# Altium schematic sheet 野火_EBF6ULL F1 核心板_原理图封装参考设计_AD格式.SchDoc
size 431 x 279 mm
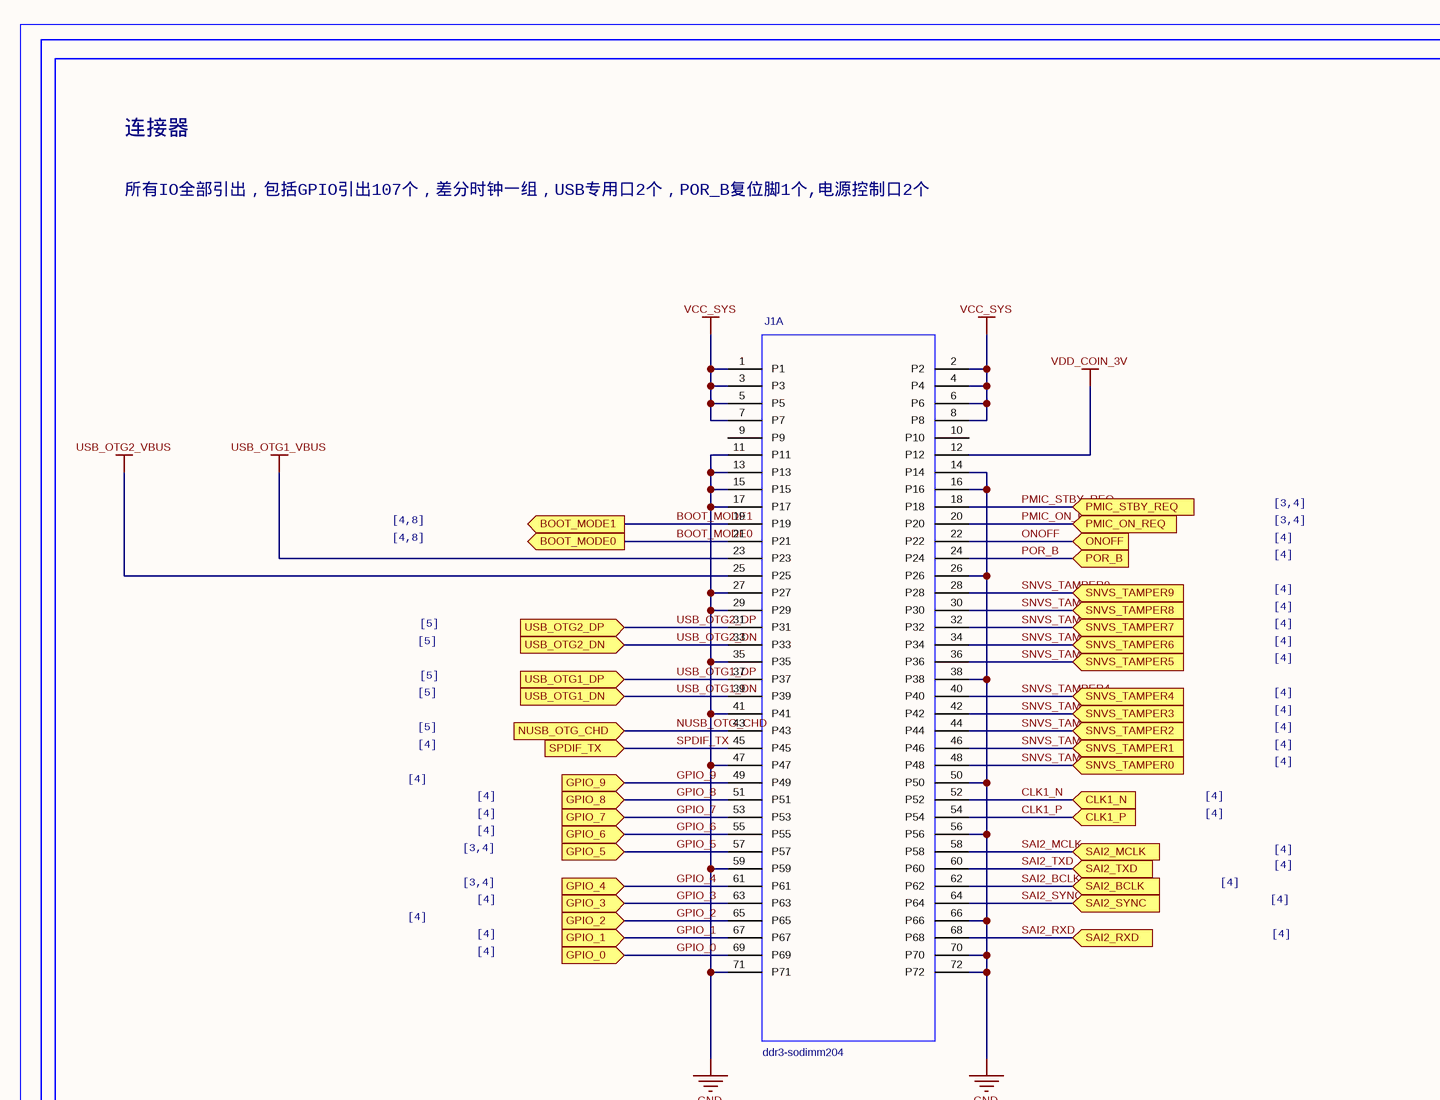
[diagram p0: 野火_EBF6ULL F1 核心板_原理图封装参考设计_AD格式.SchDoc, top left]
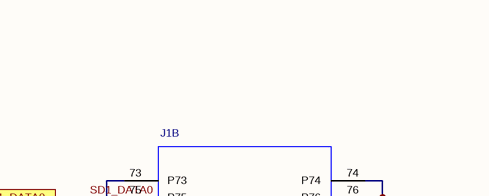
[diagram p1: 野火_EBF6ULL F1 核心板_原理图封装参考设计_AD格式.SchDoc, top right]
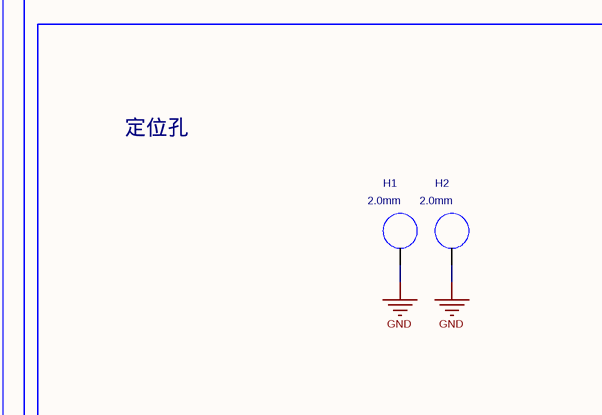
[diagram p2: 野火_EBF6ULL F1 核心板_原理图封装参考设计_AD格式.SchDoc, bottom left]
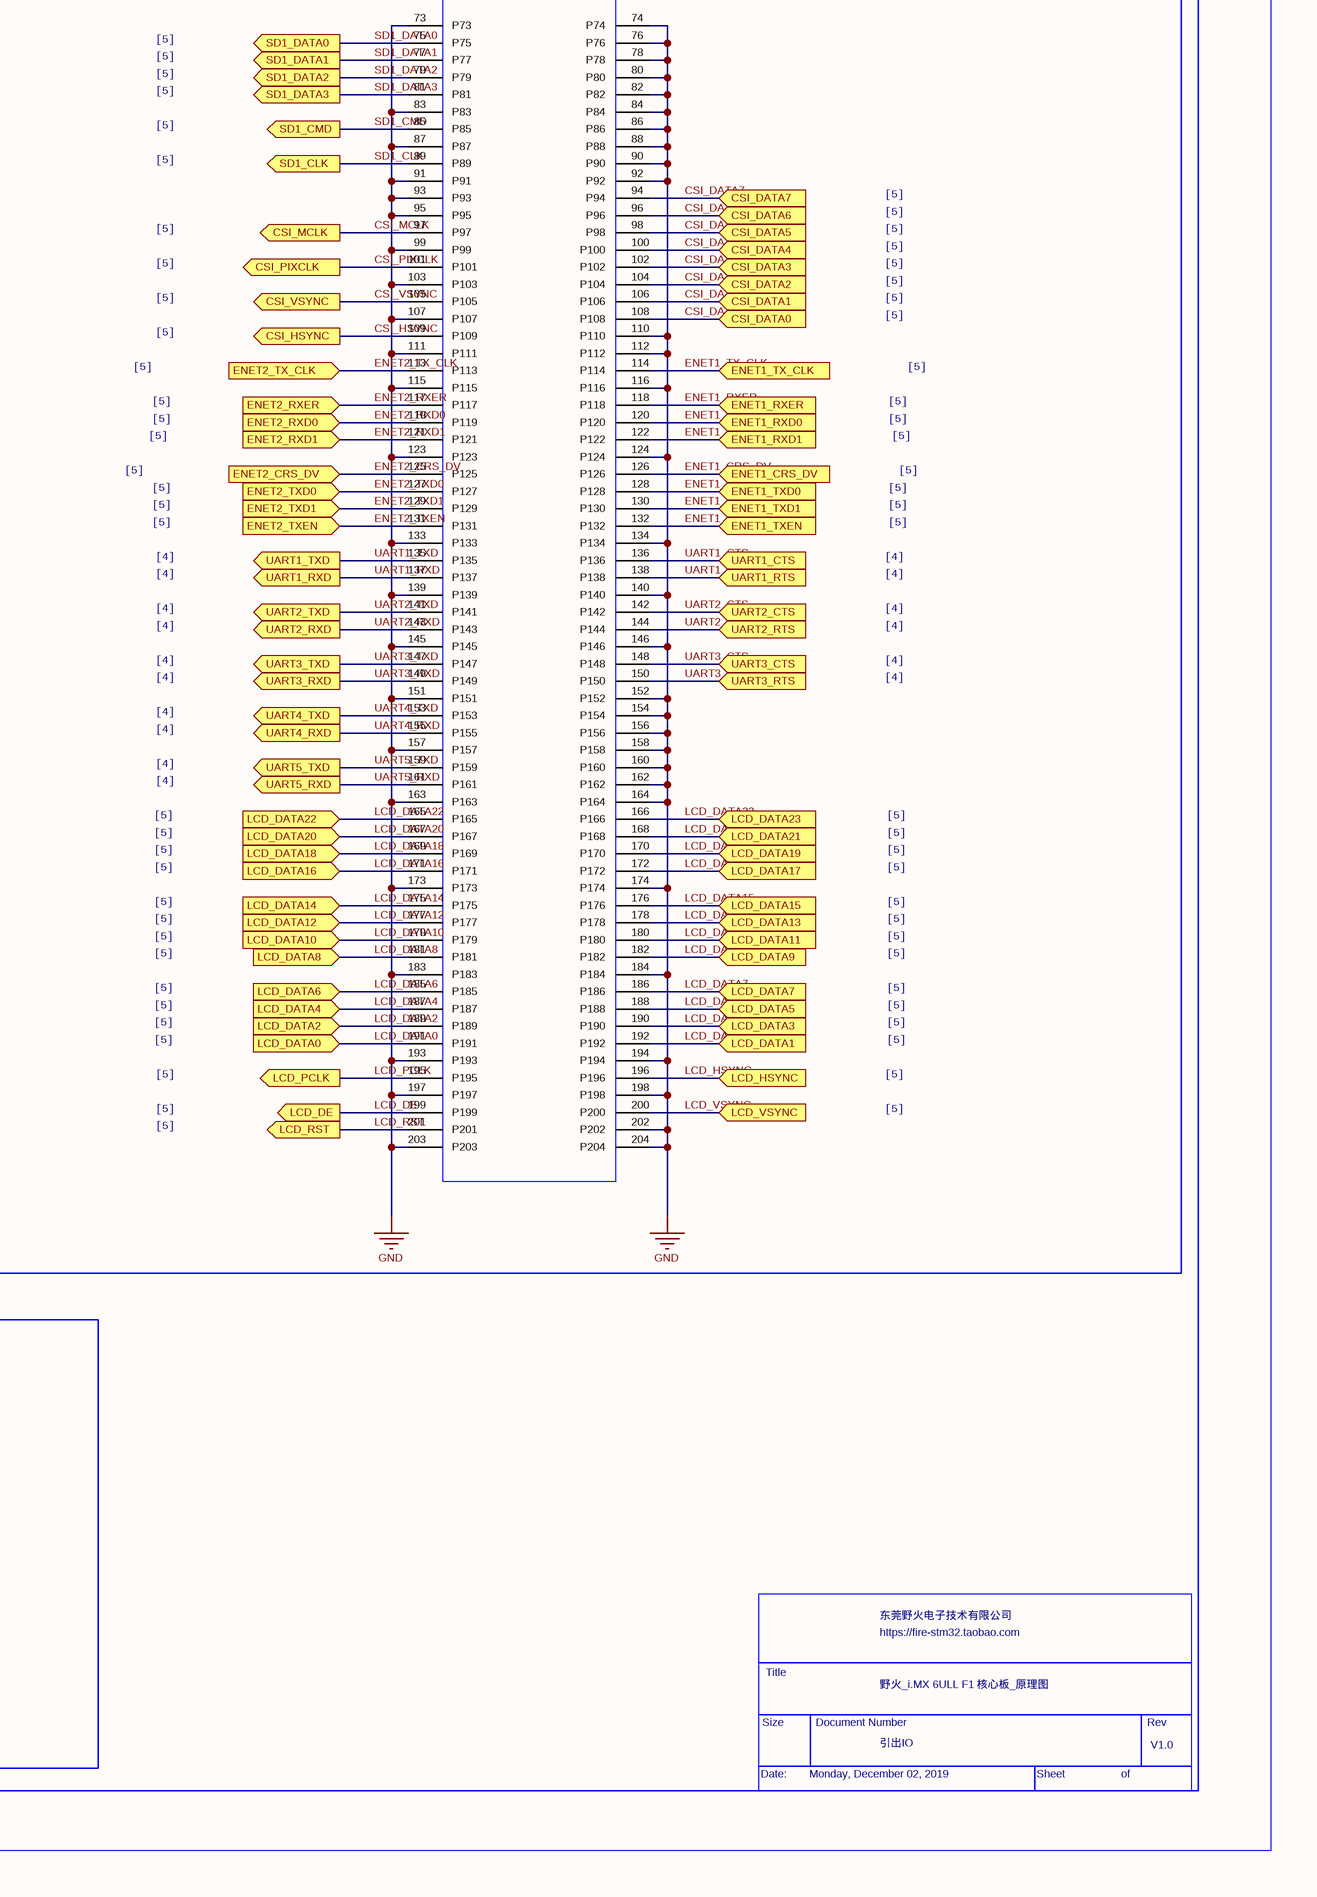
[diagram p3: 野火_EBF6ULL F1 核心板_原理图封装参考设计_AD格式.SchDoc, bottom right]

## Parts
H1  value 2.0mm  [T2_5-4]  (hidden comment: SPACER_0)
H2  value 2.0mm  [T2_5-4]  (hidden comment: SPACER_0)
J1  DDR3-SODIMM204  [DDR3-SODIMM204-GOLD_FINGER]  (parts A,B of 2)

## Blocks framed on the sheet
连接器: J1
定位孔: H1 H2

## Ports
BOOT_MODE0 (out), BOOT_MODE1 (out), CLK1_N, CLK1_P, CSI_DATA0 (in), CSI_DATA1 (in), CSI_DATA2 (in), CSI_DATA3 (in), CSI_DATA4 (in), CSI_DATA5 (in), CSI_DATA6 (in), CSI_DATA7 (in), CSI_HSYNC (out), CSI_MCLK (out), CSI_PIXCLK (out), CSI_VSYNC (out), ENET1_CRS_DV, ENET1_RXD0, ENET1_RXD1, ENET1_RXER, ENET1_TX_CLK, ENET1_TXD0, ENET1_TXD1, ENET1_TXEN, ENET2_CRS_DV, ENET2_RXD0, ENET2_RXD1, ENET2_RXER, ENET2_TX_CLK, ENET2_TXD0, ENET2_TXD1, ENET2_TXEN, GPIO_0, GPIO_1, GPIO_2, GPIO_3, GPIO_4, GPIO_5, GPIO_6, GPIO_7, GPIO_8, GPIO_9, LCD_DATA0, LCD_DATA1, LCD_DATA2, LCD_DATA3, LCD_DATA4, LCD_DATA5, LCD_DATA6, LCD_DATA7, LCD_DATA8, LCD_DATA9, LCD_DATA10, LCD_DATA11, LCD_DATA12, LCD_DATA13, LCD_DATA14, LCD_DATA15, LCD_DATA16, LCD_DATA17, LCD_DATA18, LCD_DATA19, LCD_DATA20, LCD_DATA21, LCD_DATA22, LCD_DATA23, LCD_DE (out), LCD_HSYNC (in), LCD_PCLK (out), LCD_RST (out), LCD_VSYNC (in), NUSB_OTG_CHD, ONOFF (in), PMIC_ON_REQ (in), PMIC_STBY_REQ (in), POR_B (in), SAI2_BCLK, SAI2_MCLK, SAI2_RXD, SAI2_SYNC, SAI2_TXD, SD1_CLK (out), SD1_CMD (out), SD1_DATA0 (out), SD1_DATA1 (out), SD1_DATA2 (out), SD1_DATA3 (out), SNVS_TAMPER0 (in), SNVS_TAMPER1 (in), SNVS_TAMPER2 (in), SNVS_TAMPER3 (in), SNVS_TAMPER4 (in), SNVS_TAMPER5 (in), SNVS_TAMPER6 (in), SNVS_TAMPER7 (in), SNVS_TAMPER8 (in), SNVS_TAMPER9 (in), SPDIF_TX, UART1_CTS (in), UART1_RTS (in), UART1_RXD (out), UART1_TXD (out), UART2_CTS (in), UART2_RTS (in), UART2_RXD (out), UART2_TXD (out), UART3_CTS (in), UART3_RTS (in), UART3_RXD (out), UART3_TXD (out), UART4_RXD (out), UART4_TXD (out), UART5_RXD (out), UART5_TXD (out), USB_OTG1_DN, USB_OTG1_DP, USB_OTG2_DN, USB_OTG2_DP

## Nets
GND: H1.1(NC_1) H2.1(NC_1) J1.11(P11) J1.13(P13) J1.14(P14) J1.15(P15) J1.16(P16) J1.17(P17) J1.26(P26) J1.27(P27) J1.29(P29) J1.35(P35) J1.38(P38) J1.41(P41) J1.47(P47) J1.50(P50) J1.56(P56) J1.59(P59) J1.66(P66) J1.70(P70) J1.71(P71) J1.72(P72) J1.73(P73) J1.74(P74) J1.76(P76) J1.78(P78) J1.80(P80) J1.82(P82) J1.83(P83) J1.84(P84) J1.86(P86) J1.87(P87) J1.88(P88) J1.90(P90) J1.91(P91) J1.92(P92) J1.93(P93) J1.95(P95) J1.99(P99) J1.103(P103) J1.107(P107) J1.110(P110) J1.111(P111) J1.112(P112) J1.115(P115) J1.116(P116) J1.123(P123) J1.124(P124) J1.133(P133) J1.134(P134) J1.139(P139) J1.140(P140) J1.145(P145) J1.146(P146) J1.151(P151) J1.152(P152) J1.154(P154) J1.156(P156) J1.157(P157) J1.158(P158) J1.160(P160) J1.162(P162) J1.163(P163) J1.164(P164) J1.173(P173) J1.174(P174) J1.183(P183) J1.184(P184) J1.193(P193) J1.194(P194) J1.197(P197) J1.198(P198) J1.202(P202) J1.203(P203) J1.204(P204)
USB_OTG1_VBUS: J1.23(P23)
USB_OTG2_VBUS: J1.25(P25)
VCC_SYS: J1.1(P1) J1.2(P2) J1.3(P3) J1.4(P4) J1.5(P5) J1.6(P6) J1.7(P7) J1.8(P8)
VDD_COIN_3V: J1.12(P12)
BOOT_MODE0: J1.21(P21) ; port BOOT_MODE0
BOOT_MODE1: J1.19(P19) ; port BOOT_MODE1
CLK1_N: J1.52(P52) ; port CLK1_N
CLK1_P: J1.54(P54) ; port CLK1_P
CSI_DATA0: J1.108(P108) ; port CSI_DATA0
CSI_DATA1: J1.106(P106) ; port CSI_DATA1
CSI_DATA2: J1.104(P104) ; port CSI_DATA2
CSI_DATA3: J1.102(P102) ; port CSI_DATA3
CSI_DATA4: J1.100(P100) ; port CSI_DATA4
CSI_DATA5: J1.98(P98) ; port CSI_DATA5
CSI_DATA6: J1.96(P96) ; port CSI_DATA6
CSI_DATA7: J1.94(P94) ; port CSI_DATA7
CSI_HSYNC: J1.109(P109) ; port CSI_HSYNC
CSI_MCLK: J1.97(P97) ; port CSI_MCLK
CSI_PIXCLK: J1.101(P101) ; port CSI_PIXCLK
CSI_VSYNC: J1.105(P105) ; port CSI_VSYNC
ENET1_CRS_DV: J1.126(P126) ; port ENET1_CRS_DV
ENET1_RXD0: J1.120(P120) ; port ENET1_RXD0
ENET1_RXD1: J1.122(P122) ; port ENET1_RXD1
ENET1_RXER: J1.118(P118) ; port ENET1_RXER
ENET1_TX_CLK: J1.114(P114) ; port ENET1_TX_CLK
ENET1_TXD0: J1.128(P128) ; port ENET1_TXD0
ENET1_TXD1: J1.130(P130) ; port ENET1_TXD1
ENET1_TXEN: J1.132(P132) ; port ENET1_TXEN
ENET2_CRS_DV: J1.125(P125) ; port ENET2_CRS_DV
ENET2_RXD0: J1.119(P119) ; port ENET2_RXD0
ENET2_RXD1: J1.121(P121) ; port ENET2_RXD1
ENET2_RXER: J1.117(P117) ; port ENET2_RXER
ENET2_TX_CLK: J1.113(P113) ; port ENET2_TX_CLK
ENET2_TXD0: J1.127(P127) ; port ENET2_TXD0
ENET2_TXD1: J1.129(P129) ; port ENET2_TXD1
ENET2_TXEN: J1.131(P131) ; port ENET2_TXEN
GPIO_0: J1.69(P69) ; port GPIO_0
GPIO_1: J1.67(P67) ; port GPIO_1
GPIO_2: J1.65(P65) ; port GPIO_2
GPIO_3: J1.63(P63) ; port GPIO_3
GPIO_4: J1.61(P61) ; port GPIO_4
GPIO_5: J1.57(P57) ; port GPIO_5
GPIO_6: J1.55(P55) ; port GPIO_6
GPIO_7: J1.53(P53) ; port GPIO_7
GPIO_8: J1.51(P51) ; port GPIO_8
GPIO_9: J1.49(P49) ; port GPIO_9
LCD_DATA0: J1.191(P191) ; port LCD_DATA0
LCD_DATA1: J1.192(P192) ; port LCD_DATA1
LCD_DATA2: J1.189(P189) ; port LCD_DATA2
LCD_DATA3: J1.190(P190) ; port LCD_DATA3
LCD_DATA4: J1.187(P187) ; port LCD_DATA4
LCD_DATA5: J1.188(P188) ; port LCD_DATA5
LCD_DATA6: J1.185(P185) ; port LCD_DATA6
LCD_DATA7: J1.186(P186) ; port LCD_DATA7
LCD_DATA8: J1.181(P181) ; port LCD_DATA8
LCD_DATA9: J1.182(P182) ; port LCD_DATA9
LCD_DATA10: J1.179(P179) ; port LCD_DATA10
LCD_DATA11: J1.180(P180) ; port LCD_DATA11
LCD_DATA12: J1.177(P177) ; port LCD_DATA12
LCD_DATA13: J1.178(P178) ; port LCD_DATA13
LCD_DATA14: J1.175(P175) ; port LCD_DATA14
LCD_DATA15: J1.176(P176) ; port LCD_DATA15
LCD_DATA16: J1.171(P171) ; port LCD_DATA16
LCD_DATA17: J1.172(P172) ; port LCD_DATA17
LCD_DATA18: J1.169(P169) ; port LCD_DATA18
LCD_DATA19: J1.170(P170) ; port LCD_DATA19
LCD_DATA20: J1.167(P167) ; port LCD_DATA20
LCD_DATA21: J1.168(P168) ; port LCD_DATA21
LCD_DATA22: J1.165(P165) ; port LCD_DATA22
LCD_DATA23: J1.166(P166) ; port LCD_DATA23
LCD_DE: J1.199(P199) ; port LCD_DE
LCD_HSYNC: J1.196(P196) ; port LCD_HSYNC
LCD_PCLK: J1.195(P195) ; port LCD_PCLK
LCD_RST: J1.201(P201) ; port LCD_RST
LCD_VSYNC: J1.200(P200) ; port LCD_VSYNC
NUSB_OTG_CHD: J1.43(P43) ; port NUSB_OTG_CHD
ONOFF: J1.22(P22) ; port ONOFF
PMIC_ON_REQ: J1.20(P20) ; port PMIC_ON_REQ
PMIC_STBY_REQ: J1.18(P18) ; port PMIC_STBY_REQ
POR_B: J1.24(P24) ; port POR_B
SAI2_BCLK: J1.62(P62) ; port SAI2_BCLK
SAI2_MCLK: J1.58(P58) ; port SAI2_MCLK
SAI2_RXD: J1.68(P68) ; port SAI2_RXD
SAI2_SYNC: J1.64(P64) ; port SAI2_SYNC
SAI2_TXD: J1.60(P60) ; port SAI2_TXD
SD1_CLK: J1.89(P89) ; port SD1_CLK
SD1_CMD: J1.85(P85) ; port SD1_CMD
SD1_DATA0: J1.75(P75) ; port SD1_DATA0
SD1_DATA1: J1.77(P77) ; port SD1_DATA1
SD1_DATA2: J1.79(P79) ; port SD1_DATA2
SD1_DATA3: J1.81(P81) ; port SD1_DATA3
SNVS_TAMPER0: J1.48(P48) ; port SNVS_TAMPER0
SNVS_TAMPER1: J1.46(P46) ; port SNVS_TAMPER1
SNVS_TAMPER2: J1.44(P44) ; port SNVS_TAMPER2
SNVS_TAMPER3: J1.42(P42) ; port SNVS_TAMPER3
SNVS_TAMPER4: J1.40(P40) ; port SNVS_TAMPER4
SNVS_TAMPER5: J1.36(P36) ; port SNVS_TAMPER5
SNVS_TAMPER6: J1.34(P34) ; port SNVS_TAMPER6
SNVS_TAMPER7: J1.32(P32) ; port SNVS_TAMPER7
SNVS_TAMPER8: J1.30(P30) ; port SNVS_TAMPER8
SNVS_TAMPER9: J1.28(P28) ; port SNVS_TAMPER9
SPDIF_TX: J1.45(P45) ; port SPDIF_TX
UART1_CTS: J1.136(P136) ; port UART1_CTS
UART1_RTS: J1.138(P138) ; port UART1_RTS
UART1_RXD: J1.137(P137) ; port UART1_RXD
UART1_TXD: J1.135(P135) ; port UART1_TXD
UART2_CTS: J1.142(P142) ; port UART2_CTS
UART2_RTS: J1.144(P144) ; port UART2_RTS
UART2_RXD: J1.143(P143) ; port UART2_RXD
UART2_TXD: J1.141(P141) ; port UART2_TXD
UART3_CTS: J1.148(P148) ; port UART3_CTS
UART3_RTS: J1.150(P150) ; port UART3_RTS
UART3_RXD: J1.149(P149) ; port UART3_RXD
UART3_TXD: J1.147(P147) ; port UART3_TXD
UART4_RXD: J1.155(P155) ; port UART4_RXD
UART4_TXD: J1.153(P153) ; port UART4_TXD
UART5_RXD: J1.161(P161) ; port UART5_RXD
UART5_TXD: J1.159(P159) ; port UART5_TXD
USB_OTG1_DN: J1.39(P39) ; port USB_OTG1_DN
USB_OTG1_DP: J1.37(P37) ; port USB_OTG1_DP
USB_OTG2_DN: J1.33(P33) ; port USB_OTG2_DN
USB_OTG2_DP: J1.31(P31) ; port USB_OTG2_DP

Not connected (* = marked no-connect by the designer): J1 9(P9) 10(P10)

## Notes on the sheet
- 所有IO全部引出，包括GPIO引出107个，差分时钟一组，USB专用口2个，POR_B复位脚1个,电源控制口2个
- [5]
- [4,8]
- [3,4]
- [4]
- 东莞野火电子技术有限公司
- Title
- https://fire-stm32.taobao.com
- 野火_i.MX 6ULL F1 核心板_原理图
- Date:
- Size
- Monday, December 02, 2019
- Document Number
- 引出IO
- Sheet
- of
- Rev
- V1.0

## Library data of the parts
H1 H2 = SPACER_0: FASTENER, STANDOFF 4.5MMX3.53XM3.0X0.5 ROUND THR .635"L BRASS; CAD_APPROVED: Yes; ASSY_OPT: DNP; MFG_PN01: MSS251-R-1-A-16; MFG_NAME01: UNICORP; AGILE_PN: 280-76498; Source_Path: H:\NXP_RT1050\SCH\IMXRT1052.DSN; CLASS: IC; HEIGHT: 16.13MM; ROHS: Yes; PCB DECAL: T2_5-4
J1 = DDR3-SODIMM204: Source_Path: F:\SCH-PCB\EBF_L005_SODIMM\SCH\LIBRARY1.OLB; OriginalSymbolOrigin: (-50000,200000); PCB DECAL: DDR3-SODIMM204-GOLD_FINGER; Value: ddr3-sodimm204